# EAGLE schematic MainLAN_ARM (EAGLE 6.4)

## Sheet 1 of 2
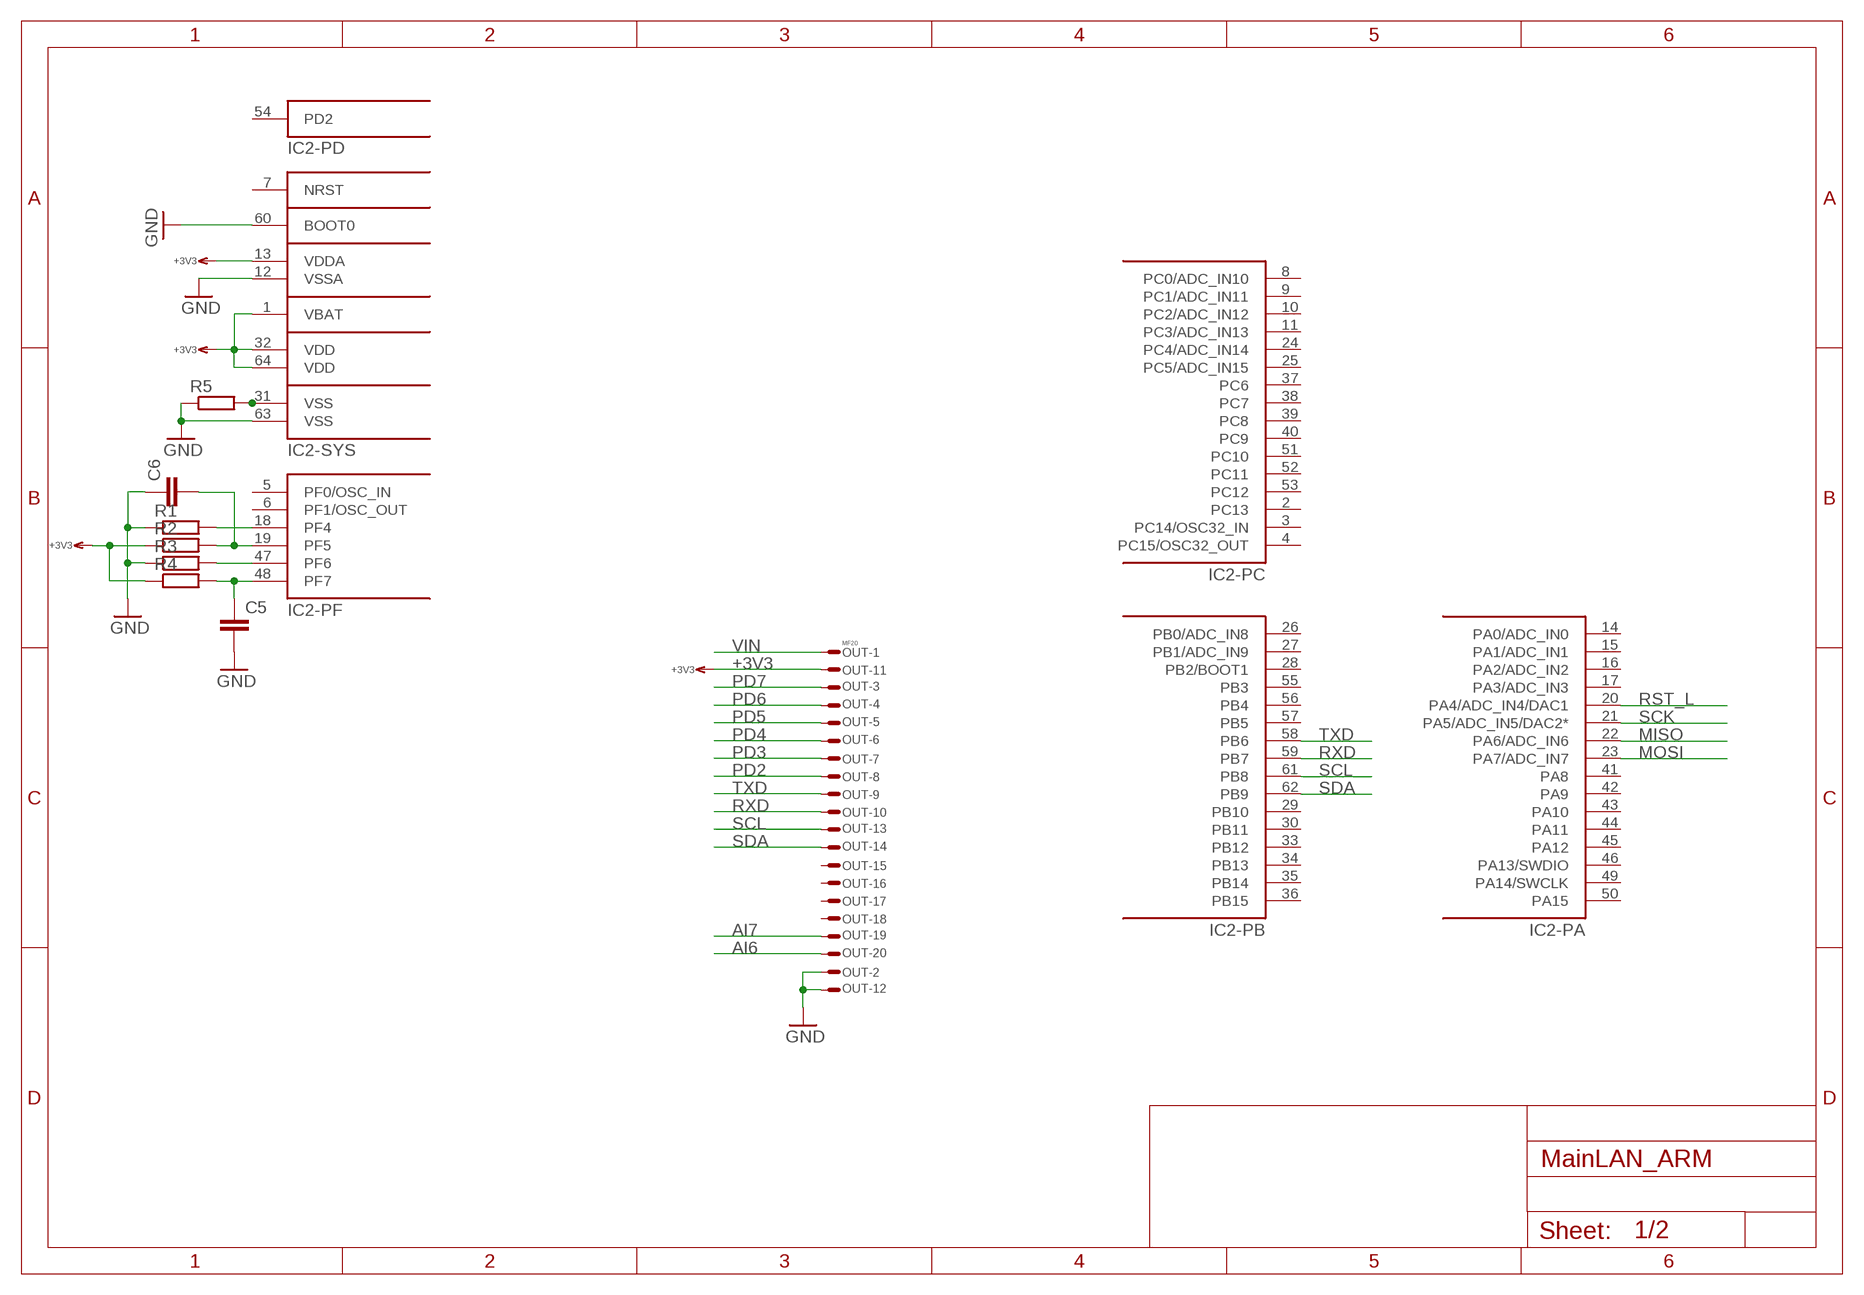
[diagram p0: schematic, sheet 1]

### Parts
C5  C0402  [0402]
C6  C0402  [0402]
IC2  STM32F0__R  [LQFP64]
OUT  MF20  ML20LSE  [ML20LS]
R1  R0402  [0402]
R2  R0402  [0402]
R3  R0603  [0603]
R4  R0603  [0603]
R5  R0603  [0603]

### Nets
+3V3: IC2.1(-SYS:VBAT) IC2.13(-SYS:VDDA) IC2.32(-SYS:VDD) IC2.64(-SYS:VDD) OUT.P$11 R2.1 R4.1 ; also sheet 2
AI6: OUT.P$20
AI7: OUT.P$19
GND: C5.2 C6.1 IC2.12(-SYS:VSSA) IC2.60(-SYS:BOOT0) IC2.63(-SYS:VSS) OUT.P$2 OUT.P$12 R1.1 R3.1 R5.1 ; also sheet 2
MISO: IC2.22(-PA:PA6/ADC_IN6) ; also sheet 2
MOSI: IC2.23(-PA:PA7/ADC_IN7) ; also sheet 2
N$1: IC2.18(-PF:PF4) R1.2
N$2: C6.2 IC2.19(-PF:PF5) R2.2
N$3: IC2.47(-PF:PF6) R3.2
N$4: C5.1 IC2.48(-PF:PF7) R4.2
N$5: IC2.31(-SYS:VSS) R5.2
PD2: OUT.P$8
PD3: OUT.P$7
PD4: OUT.P$6
PD5: OUT.P$5
PD6: OUT.P$4
PD7: OUT.P$3
RST_L: IC2.20(-PA:PA4/ADC_IN4/DAC1) ; also sheet 2
RXD: IC2.59(-PB:PB7) OUT.P$10
SCK: IC2.21(-PA:PA5/ADC_IN5/DAC2*) ; also sheet 2
SCL: IC2.61(-PB:PB8) OUT.P$13
SDA: IC2.62(-PB:PB9) OUT.P$14
TXD: IC2.58(-PB:PB6) OUT.P$9
VIN: OUT.P$1
Unconnected: IC2.2(-PC:PC13) IC2.3(-PC:PC14/OSC32_IN) IC2.4(-PC:PC15/OSC32_OUT) IC2.5(-PF:PF0/OSC_IN) IC2.6(-PF:PF1/OSC_OUT) IC2.7(-SYS:NRST) IC2.8(-PC:PC0/ADC_IN10) IC2.9(-PC:PC1/ADC_IN11) IC2.10(-PC:PC2/ADC_IN12) IC2.11(-PC:PC3/ADC_IN13) IC2.14(-PA:PA0/ADC_IN0) IC2.15(-PA:PA1/ADC_IN1) IC2.16(-PA:PA2/ADC_IN2) IC2.17(-PA:PA3/ADC_IN3) IC2.24(-PC:PC4/ADC_IN14) IC2.25(-PC:PC5/ADC_IN15) IC2.26(-PB:PB0/ADC_IN8) IC2.27(-PB:PB1/ADC_IN9) IC2.28(-PB:PB2/BOOT1) IC2.29(-PB:PB10) IC2.30(-PB:PB11) IC2.33(-PB:PB12) IC2.34(-PB:PB13) IC2.35(-PB:PB14) IC2.36(-PB:PB15) IC2.37(-PC:PC6) IC2.38(-PC:PC7) IC2.39(-PC:PC8) IC2.40(-PC:PC9) IC2.41(-PA:PA8) IC2.42(-PA:PA9) IC2.43(-PA:PA10) IC2.44(-PA:PA11) IC2.45(-PA:PA12) IC2.46(-PA:PA13/SWDIO) IC2.49(-PA:PA14/SWCLK) IC2.50(-PA:PA15) IC2.51(-PC:PC10) IC2.52(-PC:PC11) IC2.53(-PC:PC12) IC2.54(-PD:PD2) IC2.55(-PB:PB3) IC2.56(-PB:PB4) IC2.57(-PB:PB5) OUT.P$15 OUT.P$16 OUT.P$17 OUT.P$18

## Sheet 2 of 2
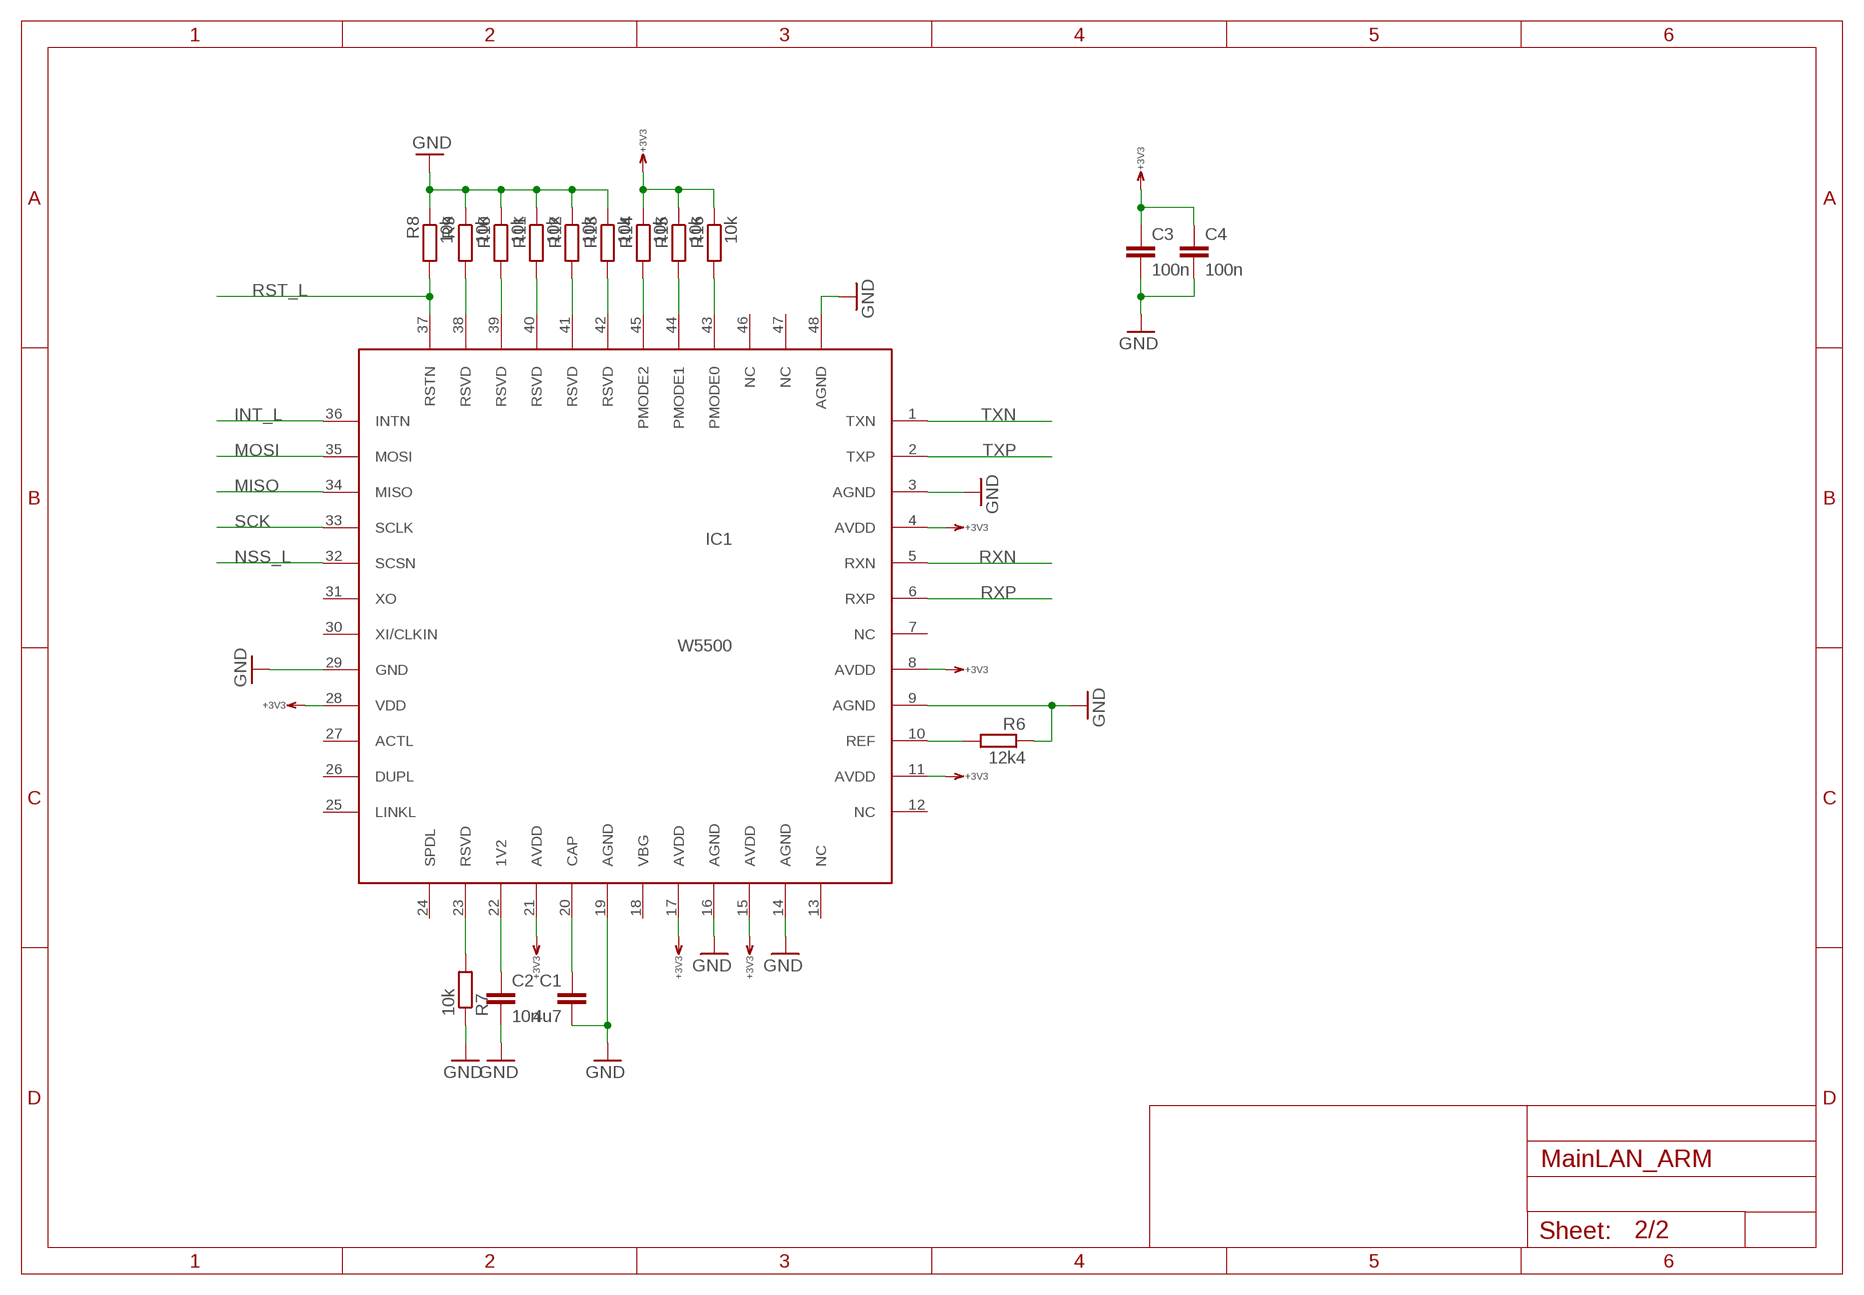
[diagram p1: schematic, sheet 2]

### Parts
C1  4u7  C0402  [0402]
C2  10n  C0402  [0402]
C3  100n  C0402  [0402]
C4  100n  C0402  [0402]
IC1  W5500  [LQFP48]
R6  12k4  R0402  [0402]
R7  10k  R0402  [0402]
R8  10k  R0402  [0402]
R9  10k  R0402  [0402]
R10  10k  R0402  [0402]
R11  10k  R0402  [0402]
R12  10k  R0402  [0402]
R13  10k  R0402  [0402]
R14  10k  R0402  [0402]
R15  10k  R0402  [0402]
R16  10k  R0402  [0402]

### Nets
+3V3: C3.1 C4.1 IC1.4(AVDD) IC1.8(AVDD) IC1.11(AVDD) IC1.15(AVDD) IC1.17(AVDD) IC1.21(AVDD) IC1.28(VDD) R14.1 R15.1 R16.1 ; also sheet 1
GND: C1.2 C2.2 C3.2 C4.2 IC1.3(AGND) IC1.9(AGND) IC1.14(AGND) IC1.16(AGND) IC1.19(AGND) IC1.29(GND) IC1.48(AGND) R6.1 R7.1 R8.1 R9.1 R10.1 R11.1 R12.1 R13.1 ; also sheet 1
INT_L: IC1.36(INTN)
MISO: IC1.34(MISO) ; also sheet 1
MOSI: IC1.35(MOSI) ; also sheet 1
N$6: IC1.10(REF) R6.2
N$7: C1.1 IC1.20(CAP)
N$8: IC1.45(PMODE2) R14.2
N$9: C2.1 IC1.22(1V2)
N$10: IC1.23(RSVD) R7.2
N$11: IC1.42(RSVD) R13.2
N$12: IC1.41(RSVD) R12.2
N$13: IC1.40(RSVD) R11.2
N$14: IC1.39(RSVD) R10.2
N$15: IC1.38(RSVD) R9.2
N$16: IC1.44(PMODE1) R15.2
N$17: IC1.43(PMODE0) R16.2
NSS_L: IC1.32(SCSN)
RST_L: IC1.37(RSTN) R8.2 ; also sheet 1
RXN: IC1.5(RXN)
RXP: IC1.6(RXP)
SCK: IC1.33(SCLK) ; also sheet 1
TXN: IC1.1(TXN)
TXP: IC1.2(TXP)
Unconnected: IC1.7(NC) IC1.12(NC) IC1.13(NC) IC1.18(VBG) IC1.24(SPDL) IC1.25(LINKL) IC1.26(DUPL) IC1.27(ACTL) IC1.30(XI/CLKIN) IC1.31(XO) IC1.46(NC) IC1.47(NC)

## Library data of the parts
C1-C6 = RCL:C: Capacitor SMD
IC1 = ICs:W5500
IC2 = STM32:STM32F0__
OUT = Conn:ML20?E: HARTING
R1-R16 = RCL:R: Resistor SMD